# EAGLE design P2N-002 (EAGLE 7.1.0)
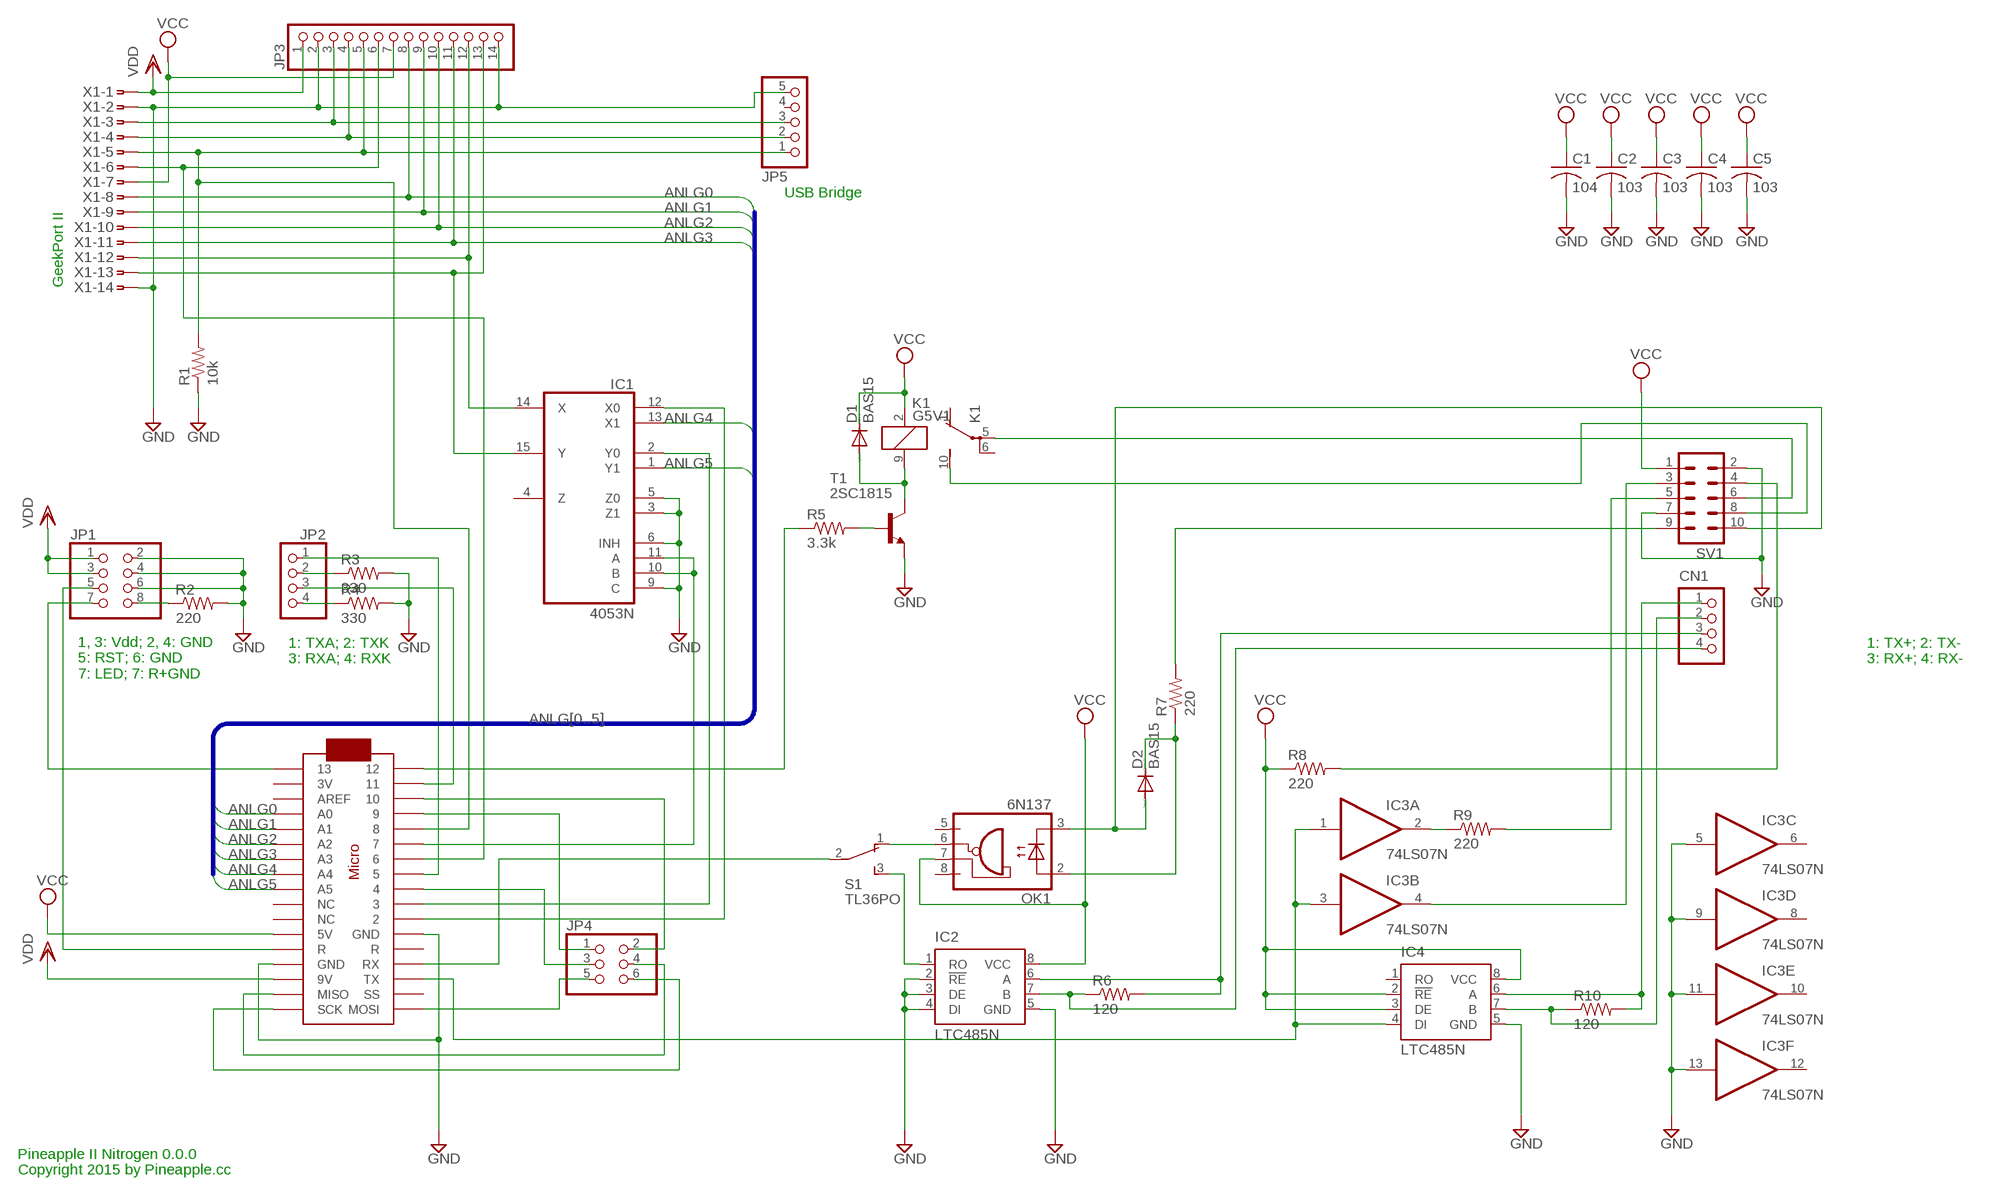
[diagram p0: schematic, sheet 1]

## Parts
C1  104  C-US025-025X050  [C025-025X050]
C2  103  C-US025-025X050  [C025-025X050]
C3  103  C-US025-025X050  [C025-025X050]
C4  103  C-US025-025X050  [C025-025X050]
C5  103  C-US025-025X050  [C025-025X050]
CN1  S4B-PH-K-S  [S4B-PH-K-S]
D1  BAS15  [DO34-7]
D2  BAS15  [DO34-7]
IC1  4053N  [DIL16]
IC2  LTC485N  [DIL08]
IC3  74LS07N  [DIL14]
IC4  LTC485N  [DIL08]
JP1  PINHD-2X4  [2X04]
JP2  PINHD-1X4  [1X04]
JP3  PINHD-1X14  [1X14]
JP4  PINHD-2X3  [2X03]
JP5  PINHD-1X5/90  [1X05/90]
K1  G5V1  [G5V1]
MC1  ARDUINOMICRO  [ARDUINOMICRO]
OK1  6N137  [DIL08]
R1  10k  R-US_0204/5  [0204/5]
R2  220  R-US_0204/5  [0204/5]
R3  330  R-US_0204/5  [0204/5]
R4  330  R-US_0204/5  [0204/5]
R5  3.3k  R-US_0204/5  [0204/5]
R6  120  R-US_0204/5  [0204/5]
R7  220  R-US_0204/5  [0204/5]
R8  220  R-US_0204/5  [0204/5]
R9  220  R-US_0204/5  [0204/5]
R10  120  R-US_0204/5  [0204/5]
S1  TL36PO  [TL3XPO]
SV1  ML10L  [ML10L]
T1  2SC1815  [TO92-ECB]
X1  HIROSE-DXLM  [HIROSE-DXLM]

## Nets
ANLG0: JP3.8 MC1.P$31(A0) X1.8
ANLG1: JP3.9 MC1.P$30(A1) X1.9
ANLG2: JP3.10 MC1.P$29(A2) X1.10
ANLG3: JP3.11 MC1.P$28(A3) X1.11
ANLG4: IC1.13(X1) MC1.P$27(A4)
ANLG5: IC1.1(Y1) MC1.P$26(A5)
GEEK16: IC1.10(B) IC1.11(A) MC1.P$6
GND: C1.2 C2.2 C3.2 C4.2 C5.2 IC1.3(Z1) IC1.5(Z0) IC1.6(INH) IC1.9(C) IC2.2(!RE) IC2.3(DE) IC2.4(DI) IC2.5(GND) IC3.5(C:I) IC3.9(D:I) IC3.11(E:I) IC3.13(F:I) IC4.5(GND) JP1.2 JP1.4 JP1.6 JP3.2 JP3.14 JP5.5 MC1.P$12(GND) MC1.P$21(GND) R1.1 R2.2 R3.2 R4.2 SV1.2 SV1.7 T1.E X1.2 X1.14
MIDI1: CN1.1 IC4.6(A) R10.2
MIDI3: CN1.2 IC4.7(B) R10.1
MIDI6: IC3.1(A:I) IC3.3(B:I) IC4.4(DI) MC1.P$15(TX)
MIDI11: CN1.3 IC2.6(A) R6.2
MIDI13: CN1.4 IC2.7(B) R6.1
MIDI15: D2.A OK1.3(C) SV1.10
MIDIRX: OK1.6(VO) S1.1(O)
N$1: IC3.4(B:O) SV1.3
N$2: IC3.2(A:O) R9.1
N$3: JP1.5 MC1.P$13(R)
N$4: JP1.7 MC1.P$34
N$5: R7.2 SV1.9
N$6: D1.A K1.9 T1.C
N$7: MC1.P$14(RX) S1.2(P)
N$8: R5.2 T1.B
N$9: JP4.3 MC1.P$9
N$10: R9.2 SV1.5
N$11: JP4.5 MC1.P$17(MOSI)
N$12: R8.2 SV1.4
N$13: JP4.6 MC1.P$18(SCK)
N$14: K1.10(2:S) SV1.8
N$15: D2.C OK1.2(A) R7.1
N$16: K1.5(2:P) SV1.6
N$17: JP2.2 R3.1
N$18: JP2.4 R4.1
N$19: IC1.2(Y0) MC1.P$10
N$20: JP2.1 MC1.P$8
N$21: JP2.3 MC1.P$2
N$22: MC1.P$1 R5.1
N$23: IC1.12(X0) MC1.P$11
N$24: JP3.5 JP5.1 MC1.P$5 R1.2 X1.5
N$25: JP3.4 JP5.2 X1.4
N$26: JP3.3 JP5.3 X1.3
N$27: JP3.6 MC1.P$7 X1.6
N$28: IC1.14(X) JP3.12 X1.12
N$29: IC1.15(Y) JP3.13 X1.13
N$30: JP4.1 MC1.P$4
N$31: JP4.2 MC1.P$3
N$32: JP1.8 R2.1
N$33: JP4.4 MC1.P$19(MISO)
VCC: C1.1 C2.1 C3.1 C4.1 C5.1 D1.C IC2.8(VCC) IC4.2(!RE) IC4.3(DE) IC4.8(VCC) JP3.7 K1.2 MC1.P$23(5V) OK1.7(VE) R8.1 SV1.1 X1.7
VDD: JP1.1 JP1.3 JP3.1 MC1.P$20(9V) X1.1
XMIDIRX: IC2.1(RO) S1.3(S)
Unconnected: IC1.4(Z) IC3.6(C:O) IC3.8(D:O) IC3.10(E:O) IC3.12(F:O) IC4.1(RO) JP5.4 K1.1(2:O) K1.6(2:P) MC1.P$16(SS) MC1.P$22(R) MC1.P$24(NC) MC1.P$25(NC) MC1.P$32(AREF) MC1.P$33(3V) OK1.5(GND) OK1.8(VCC)

## Buses
ANLG[0..5]

## Notes on the sheet
- USB Bridge
- GeekPort II
- 1: TXA; 2: TXK
  3: RXA; 4: RXK
- 1: TX+; 2: TX-
  3: RX+; 4: RX-
- 1, 3: Vdd; 2, 4: GND
  5: RST; 6: GND
  7: LED; 7: R+GND
- Pineapple II Nitrogen 0.0.0
  Copyright 2015 by Pineapple.cc

## Power pins joined to a net without a drawn wire
GND: IC1.8(GND) IC3.7(P:GND)
VCC: IC1.16(VCC) IC3.14(P:VCC)
VEE: IC1.7(VEE)

## Library data of the parts
C1-C5 = rcl:C-US: CAPACITOR, American symbol
CN1 = jst-ph:S4B-PH-*: Wire-to-Board 2.0mm pitch side mount connector Source: http://www.jst-mfg.com/product/pdf/jpn/PH.pdf http://www.jst-mfg.com/product/detail.php?series=199
D1 D2 = diode:BAS15: DIODE high speed
IC1 = 40xx:4053: Triple 2-channel ANALOG MULTIPLEXER
IC2 IC4 = linear-technology:LTC485: Low Power RS485 Interface Transceiver Source: http://www.linear.com/pc/downloadDocument.do?navId=H0,C1,C1007,C1017,P2064,D1718; OC_FARNELL: unknown; OC_NEWARK: unknown
IC3 = 74xx-us:74*07: Hex BUFFER, open collector high-voltage output
JP1 = pinhead:PINHD-2X4: PIN HEADER
JP2 = pinhead:PINHD-1X4: PIN HEADER
JP3 = pinhead:PINHD-1X14: PIN HEADER
JP4 = pinhead:PINHD-2X3: PIN HEADER
JP5 = pinhead:PINHD-1X5: PIN HEADER
K1 = relay:G5V1: RELAY 1 x switch, 0.5 A/125 V AC, 1 A/24 V DC , Omron; MPN: G5V-1-DC24; OC_FARNELL: 9949593; OC_NEWARK: 36M6377
MC1 = adafruit:ARDUINOMICRO
OK1 = optocoupler:6N137: MOTOROLA OPTO COUPLER; MPN: 6N137; OC_FARNELL: 1328376; OC_NEWARK: 52M1895
R1-R10 = resistor:R-US_: RESISTOR, American symbol
S1 = switch:TL36PO: TINY SWITCH ON - ON Source: http://www2.produktinfo.conrad.com/datenblaetter/700000-724999/705152-da-01-de-Subminiaturschalter_TL_36YO.pdf
SV1 = con-ml:ML10L: HARTING; OC_FARNELL: unknown; OC_NEWARK: unknown
T1 = transistor:2SC1815: NPN EPITAXIAL TRANSISTOR Source: TOSHIBA .. 2SC1815 1.pdf
X1 = con-hirose-dxlm:HIROSE-DXLM: Hirose DXLM connector

## Board
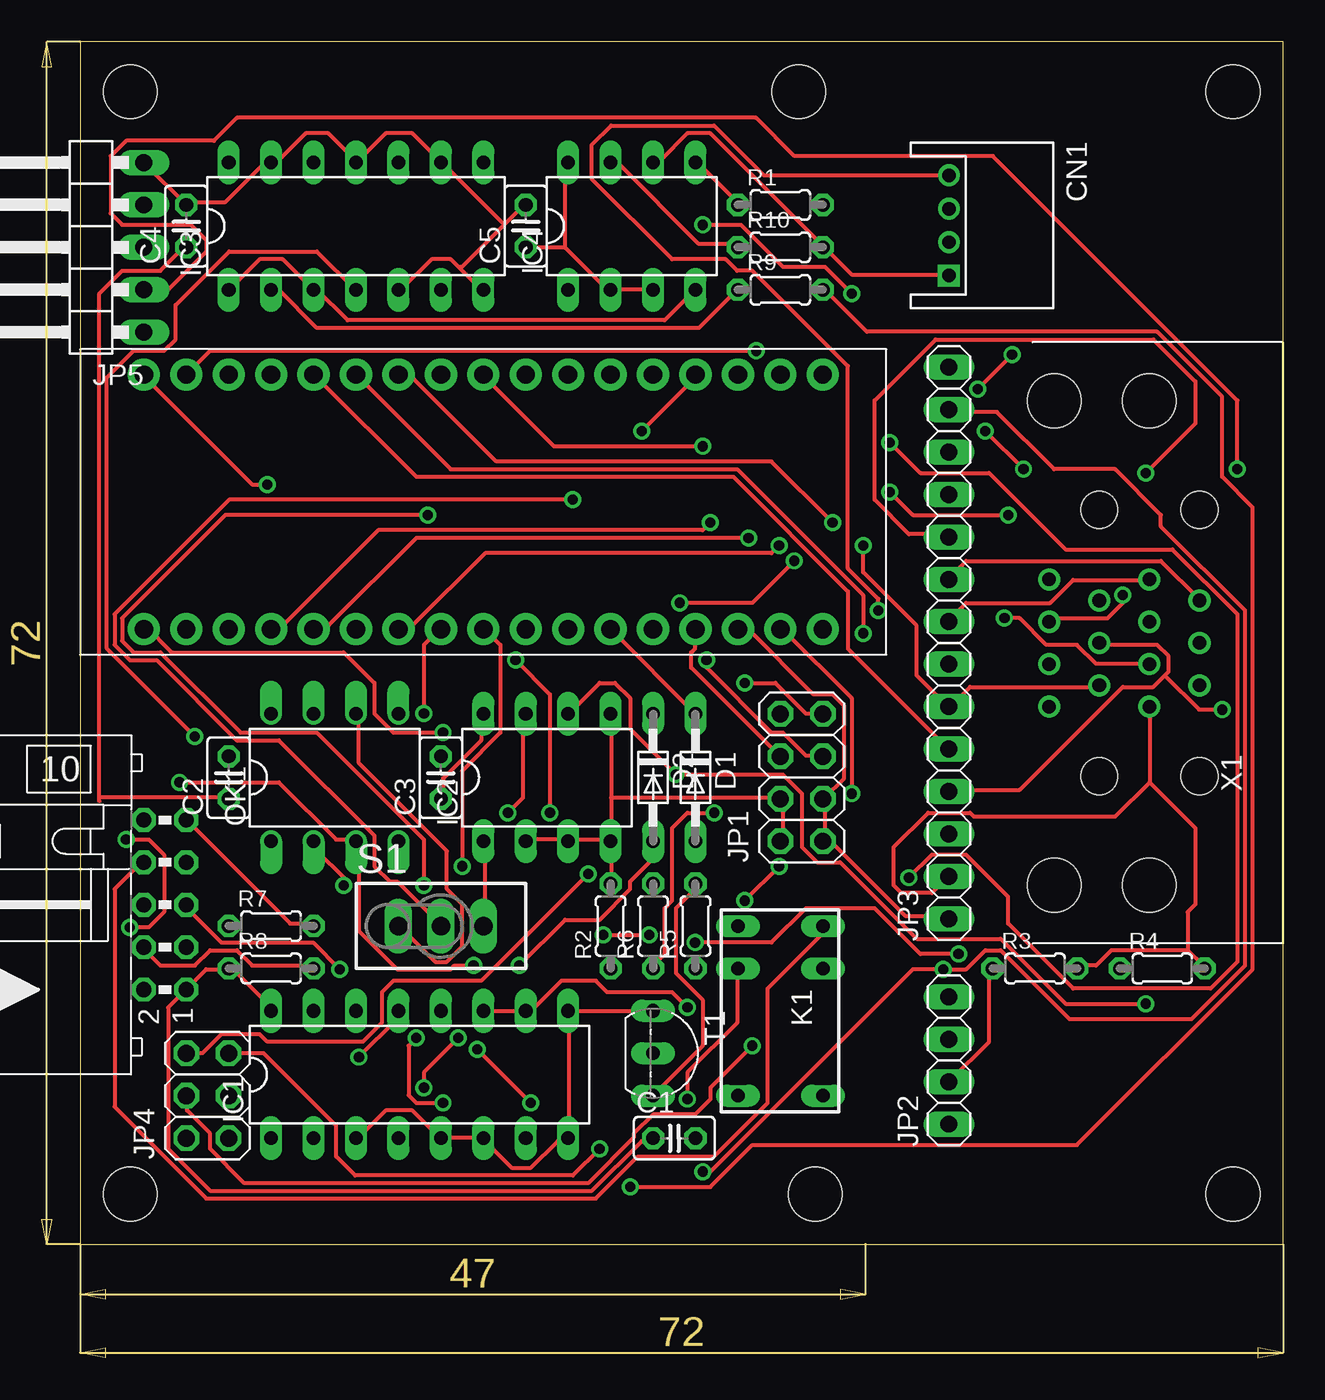
[diagram p1: board, top side]
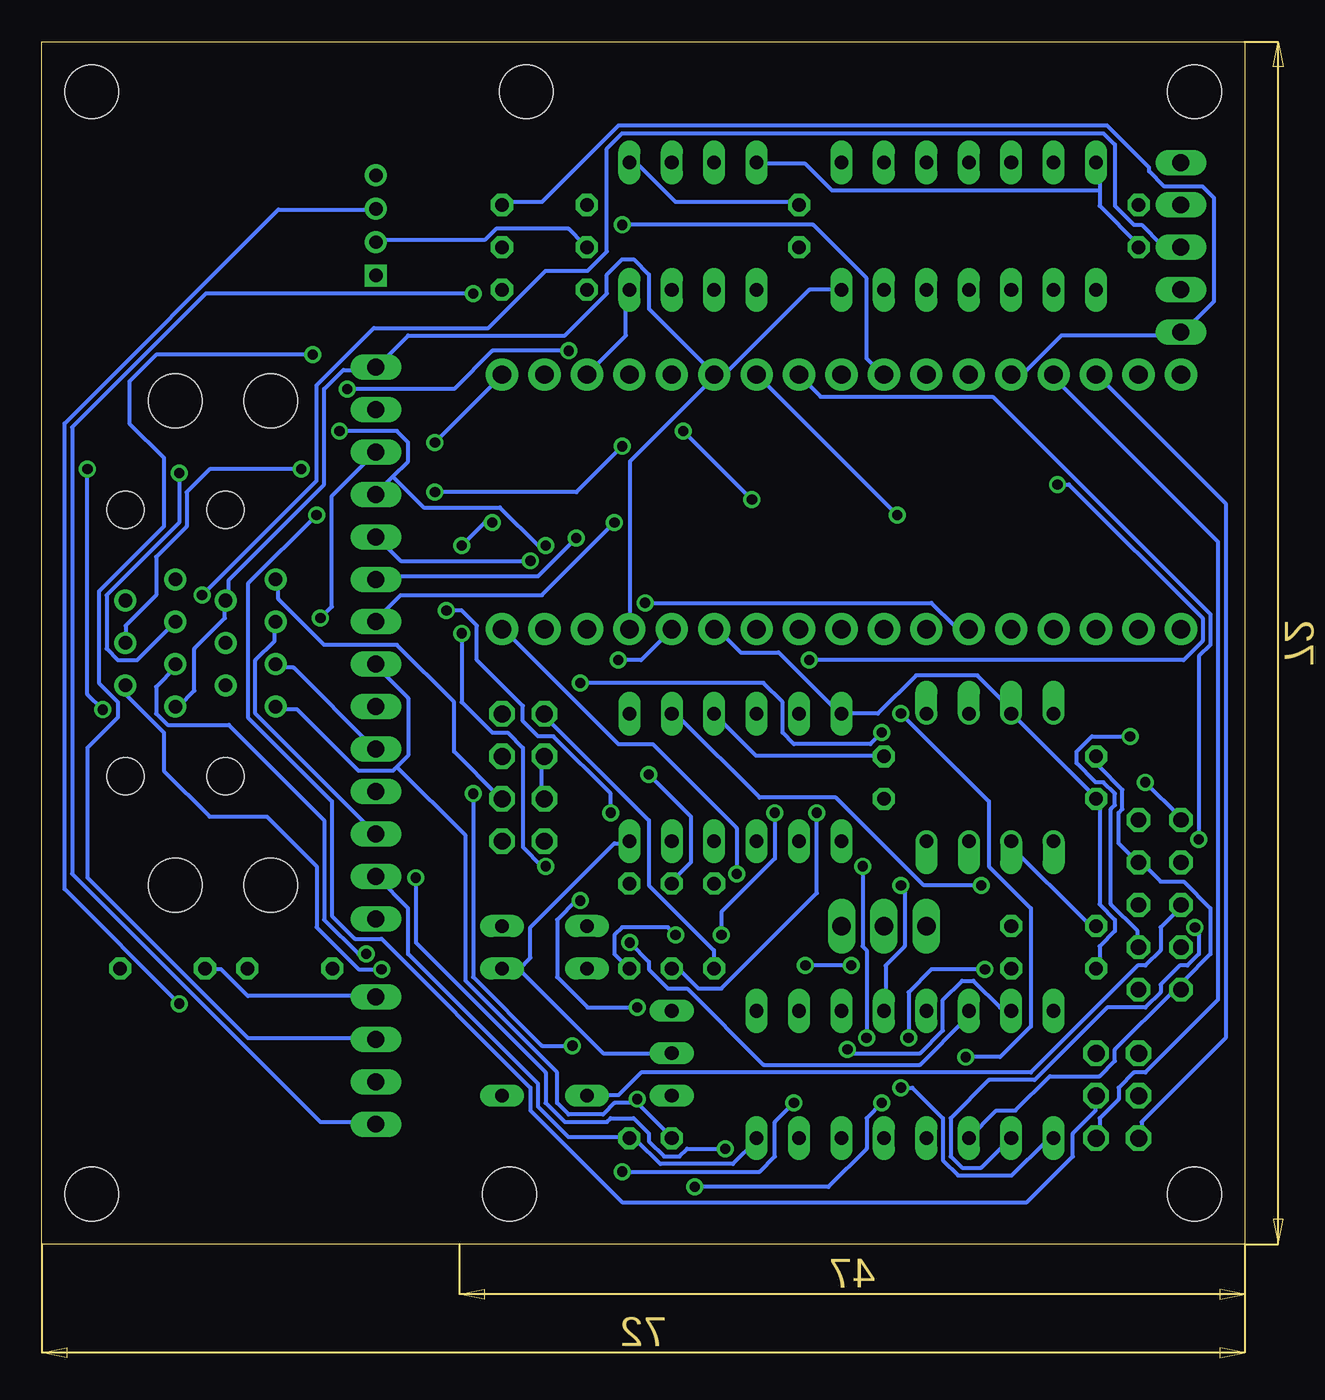
[diagram p2: board, bottom side, seen from below]

Size 72 x 72 mm. Coordinates in mm from the lower left corner, seen from the top.
Outline: 0,0 72,0 72,72 0,72 0,0
Copper layers (1*16): Top 0.035mm / dielectric 1.5mm / Bottom 0.035mm
Design rules "default": minimum track width 10mil, minimum drill 24mil, track to track 8mil, track to pad 8mil, pad to pad 8mil, via to via 8mil, smd to smd 8mil, copper to edge 40mil, drill to drill 8mil, minimum pad ring 10mil, minimum via ring 8mil, stop-mask expansion 4mil, vias tented up to drill 0mil, thermal gap 10mil
Holes 3.2 mm at 3,3 3,69 69,3 69,69 44,3 43,69

### Footprints (pad centres in the part's own frame; a part is rotated, then mirrored left to right if it is on the bottom)
C025-025X050 = drill 0.813 octagon: 1 -1.27,0; 2 1.27,0
S4B-PH-K-S = drill 0.8 square: 1 3,0 | drill 0.8: 2 1,0; 3 -1,0; 4 -3,0
DO34-7 = drill 0.813 long: A 3.81,0; C -3.81,0
DIL16 = drill 0.813 long: 1 -8.89,-3.81; 2 -6.35,-3.81; 3 -3.81,-3.81; 4 -1.27,-3.81; 5 1.27,-3.81; 6 3.81,-3.81; 7 6.35,-3.81; 8 8.89,-3.81; 9 8.89,3.81; 10 6.35,3.81; 11 3.81,3.81; 12 1.27,3.81; 13 -1.27,3.81; 14 -3.81,3.81; 15 -6.35,3.81; 16 -8.89,3.81
DIL08 = drill 0.813 long: 1 -3.81,-3.81; 2 -1.27,-3.81; 3 1.27,-3.81; 4 3.81,-3.81; 5 3.81,3.81; 6 1.27,3.81; 7 -1.27,3.81; 8 -3.81,3.81
DIL14 = drill 0.813 long: 1 -7.62,-3.81; 2 -5.08,-3.81; 3 -2.54,-3.81; 4 0,-3.81; 5 2.54,-3.81; 6 5.08,-3.81; 7 7.62,-3.81; 8 7.62,3.81; 9 5.08,3.81; 10 2.54,3.81; 11 0,3.81; 12 -2.54,3.81; 13 -5.08,3.81; 14 -7.62,3.81
2X04 = drill 1.016 octagon: 1 -3.81,-1.27; 2 -3.81,1.27; 3 -1.27,-1.27; 4 -1.27,1.27; 5 1.27,-1.27; 6 1.27,1.27; 7 3.81,-1.27; 8 3.81,1.27
1X04 = drill 1.016 long: 1 -3.81,0; 2 -1.27,0; 3 1.27,0; 4 3.81,0
1X14 = drill 1.016 long: 1 -16.51,0; 2 -13.97,0; 3 -11.43,0; 4 -8.89,0; 5 -6.35,0; 6 -3.81,0; 7 -1.27,0; 8 1.27,0; 9 3.81,0; 10 6.35,0; 11 8.89,0; 12 11.43,0; 13 13.97,0; 14 16.51,0
2X03 = drill 1.016 octagon: 1 -2.54,-1.27; 2 -2.54,1.27; 3 0,-1.27; 4 0,1.27; 5 2.54,-1.27; 6 2.54,1.27
1X05/90 = drill 1.016 long: 1 -5.08,-3.81; 2 -2.54,-3.81; 3 0,-3.81; 4 2.54,-3.81; 5 5.08,-3.81
G5V1 = drill 0.813 long: 1 -5.08,-2.54; 2 -2.54,-2.54; 5 5.08,-2.54; 6 5.08,2.54; 9 -2.54,2.54; 10 -5.08,2.54
ARDUINOMICRO = drill 1.1 pad 1.93: P$1 -20.32,7.62; P$2 -17.78,7.62; P$3 -15.24,7.62; P$4 -12.7,7.62; P$5 -10.16,7.62; P$6 -7.62,7.62; P$7 -5.08,7.62; P$8 -2.54,7.62; P$9 0,7.62; P$10 2.54,7.62; P$11 5.08,7.62; P$12 12.7,-7.62; P$13 10.16,-7.62; P$14 12.7,7.62; P$15 15.24,7.62; P$16 17.78,7.62; P$17 20.32,7.62; P$18 20.32,-7.62; P$19 17.78,-7.62; P$20 15.24,-7.62; P$21 7.62,7.62; P$22 10.16,7.62; P$23 7.62,-7.62; P$24 5.08,-7.62; P$25 2.54,-7.62; P$26 0,-7.62; P$27 -2.54,-7.62; P$28 -5.08,-7.62; P$29 -7.62,-7.62; P$30 -10.16,-7.62; P$31 -12.7,-7.62; P$32 -15.24,-7.62; P$33 -17.78,-7.62; P$34 -20.32,-7.62
DIL08' = drill 0.813 offset: 1 -3.81,-3.81; 2 -1.27,-3.81; 3 1.27,-3.81; 4 3.81,-3.81; 5 3.81,3.81; 6 1.27,3.81; 7 -1.27,3.81; 8 -3.81,3.81
0204/5 = drill 0.813 octagon: 1 -2.54,0; 2 2.54,0
TL3XPO = drill 1.1 pad 1.422 long: 1 -2.54,0; 2 0,0; 3 2.54,0
ML10L = drill 0.914 octagon: 1 -5.08,-1.27; 2 -5.08,1.27; 3 -2.54,-1.27; 4 -2.54,1.27; 5 0,-1.27; 6 0,1.27; 7 2.54,-1.27; 8 2.54,1.27; 9 5.08,-1.27; 10 5.08,1.27
TO92-ECB = drill 0.813 long: B 2.54,0; C 0,0; E -2.54,0
HIROSE-DXLM = drill 0.813: 1 3.81,9; 2 2.54,6; 3 1.27,9; 4 0,6; 5 -1.27,9; 6 -2.54,6; 7 -3.81,9; 8 3.81,3; 9 2.54,0; 10 1.27,3; 11 0,0; 12 -1.27,3; 13 -2.54,0; 14 -3.81,3 | hole 2.2: -7.97,6; 7.97,0; -7.97,0; 7.97,6 | hole 3.2: 14.5,3; -14.5,3; -14.5,8.7; 14.5,8.7

### Placement (x,y rotation side)
C1  35.56,6.35 0 top
C2  8.89,27.94 90 top
C3  21.59,27.94 90 top
C4  6.35,60.96 90 top
C5  26.67,60.96 90 top
CN1  52,61 270 top
D1  36.83,27.94 270 top
D2  34.29,27.94 270 top
IC1  20.32,10.16 0 top
IC2  27.94,27.94 0 top
IC3  16.51,60.96 0 top
IC4  33.02,60.96 0 top
JP1  43.18,27.94 90 top
JP2  52,11 90 top
JP3  52,36 90 top
JP4  7.62,8.89 90 top
JP5  0,59.69 90 top
K1  41.91,13.97 270 top
MC1  24.13,44.45 0 top
OK1  6N137  [DIL08']  15.24,27.94 0 top
R1  41.91,62.23 0 top
R2  31.75,19.05 90 top
R3  57.15,16.51 0 top
R4  64.77,16.51 0 top
R5  36.83,19.05 90 top
R6  34.29,19.05 90 top
R7  11.43,19.05 0 top
R8  11.43,16.51 0 top
R9  41.91,57.15 0 top
R10  41.91,59.69 0 top
S1  21.59,19.05 0 top
SV1  5.08,20.32 90 top
T1  34.29,11.43 270 top
X1  67,36 90 top

### Tracks (layer width: path | path; a pad name or v marks a point on that pad's centre or on a via)
ANLG0  (via drill 0.61)
  Top 0.254: X1.8 63.78,39.78 59.44,39.78 58.06,38.41 53.03,38.41 52.12,37.49 JP3.8 | v37.72,43.2 37.26,42.75 17.83,42.75 12.12,37.03 11.43,37.03 MC1.P$31
  Bottom 0.254: v37.72,43.2 42.06,38.86 50.52,38.86 51.89,37.49 JP3.8
ANLG1  (via drill 0.61)
  Top 0.254: X1.9 66.98,38.63 64.69,40.92 53.03,40.92 52.12,40.01 JP3.9 | v40.01,42.29 20.12,42.29 14.86,37.03 14.17,37.03 MC1.P$30
  Bottom 0.254: v40.01,42.29 42.29,40.01 51.89,40.01 JP3.9
ANLG2  (via drill 0.61)
  Top 0.254: v63.78,46.18 66.75,49.15 66.75,51.66 64.24,54.18 51.21,54.18 47.55,50.52 47.55,44.58 49.61,42.52 51.89,42.52 JP3.10 | v35.89,38.41 40.23,38.41 v42.75,40.92
  Bottom 0.254: v63.78,46.18 63.78,43.2 68.12,38.86 68.12,35.66 67.44,34.98 66.29,34.98 X1.10 | v35.89,38.41 18.75,38.41 17.37,37.03 16.69,37.03 MC1.P$29 | v42.75,40.92 50.52,40.92 51.89,42.29 JP3.10
ANLG3  (via drill 0.61)
  Top 0.254: v54.18,48.69 v56.46,46.41 | v41.83,41.83 41.38,41.38 24.23,41.38 19.89,37.03 19.2,37.03 MC1.P$28
  Bottom 0.254: v56.46,46.41 61.95,46.41 63.32,45.03 63.32,42.98 65.15,41.15 65.15,38.86 66.98,37.03 66.98,36.12 X1.11 | v54.18,48.69 50.75,48.69 50.06,48.01 50.06,46.86 50.98,45.95 | 50.98,45.95 51.89,45.03 JP3.11 | v41.83,41.83 42.29,41.83 44.58,44.12 49.15,44.12 50.98,45.95
ANLG4  (via drill 0.61)
  Top 0.254: v16.69,11.2 18.97,13.49 18.97,13.95 IC1.13 | v20.57,31.77 20.57,35.89 21.49,36.8 MC1.P$27
  Bottom 0.254: v16.69,11.2 14.63,11.2 12.8,13.03 12.8,20.12 15.32,22.63 15.32,26.52 v20.57,31.77
ANLG5  (via drill 0.61)
  Top 0.254: v20.57,9.37 20.57,10.29 v22.63,12.34 | v22.86,22.63 22.86,28.35 25.15,30.63 25.15,35.89 24.23,36.8 MC1.P$26
  Bottom 0.254: v20.57,9.37 19.89,9.37 18.06,7.54 18.06,5.03 17.14,4.12 13.95,4.12 11.89,6.17 11.43,6.17 IC1.1 | v22.63,12.34 22.63,17.6 22.86,17.83 v22.86,22.63
GEEK16  (via drill 0.61)
  Top 0.254: IC1.11 24.23,13.95 26.52,13.95 IC1.10 26.75,14.17 27.2,14.17 28.8,15.77 30.86,15.77 31.55,15.09 35.43,15.09 v36.35,14.17 | v41.83,22.63 v39.78,20.57 | v46.86,36.58 46.86,38.86 39.32,46.41 22.17,46.41 MC1.P$6
  Bottom 0.254: v36.35,14.17 39.32,14.17 41.15,16 41.15,19.43 40.01,20.57 v39.78,20.57 | v41.83,22.63 42.06,22.63 43.2,23.77 43.2,29.72 44.12,30.63 45.03,30.63 46.86,32.46 v46.86,36.58
GND
  Top 0.254: JP1.2 42.06,24.23 42.06,26.52 JP1.4 41.83,26.75 31.77,26.75 | MC1.P$12 36.8,36.8 36.8,35.66 36.58,35.43 36.58,34.52 41.83,29.26 JP1.6 | R2.2 31.77,21.72 31.77,24 IC2.4 | IC2.2 26.75,24.23 29.03,24.23 IC2.3 29.26,24.23 31.55,24.23 IC2.4 | 31.77,26.75 31.77,31.55 IC2.5 | 31.77,26.75 31.77,24.23 IC2.4 | JP5.5 C4.2 6.4,62.41 8.69,62.41 10.97,64.69 11.43,64.69 IC3.13 11.43,64.92 11.89,64.92 13.49,66.52 14.86,66.52 16.46,64.92 IC3.11 16.69,64.92 18.29,66.52 19.89,66.52 21.49,64.92 IC3.9 21.72,64.69 25.38,61.04 | IC4.5 37.03,64.69 39.32,62.41 R1.1 | 22.63,58.52 24,57.15 IC3.7 | 22.63,58.52 22.17,58.98 21.03,58.98 19.2,57.15 IC3.5 | 25.38,61.04 22.86,58.52 22.63,58.52 | 25.38,61.04 26.52,62.18 C5.2 | 66.29,17.6 61.72,17.6 60.81,16.69 59.89,16.69 R3.2 | 66.29,17.6 67.21,16.69 R4.2 | 66.29,17.6 66.29,19.89 66.75,20.34 66.75,24.92 64.01,27.66 | 64.01,27.66 64.01,32 X1.14 | 29.26,13.95 34.29,13.95 T1.E | IC1.3 16.69,6.4 18.29,8 19.89,8 21.49,6.4 IC1.5 21.72,6.4 24,6.4 IC1.6 24.23,6.17 25.83,4.57 26.98,4.57 28.57,6.17 29.03,6.17 IC1.8 29.26,6.4 29.26,13.95 | 29.26,13.95 IC1.9 | 64.01,27.66 61.95,25.6 53.49,25.6 53.26,25.83 50.75,25.83 48.69,23.77 48.69,21.49 49.15,21.03 50.98,21.03 51.89,21.95 JP3.2
  Bottom 0.254: JP1.6 42.06,29.03 42.06,26.75 JP1.4 | IC2.5 29.26,29.26 21.72,29.26 C3.2 | IC3.7 26.06,57.15 31.09,52.12 31.55,52.12 MC1.P$21 | IC4.5 36.8,64.69 36.35,64.69 34.06,62.41 26.75,62.41 C5.2 | MC1.P$12 36.8,37.03 36.8,46.86 31.77,51.89 MC1.P$21 | X1.14 63.78,32.23 62.87,33.15 62.87,35.66 61.04,37.49 61.04,38.41 X1.2 60.81,38.63 60.81,39.78 55.09,45.49 55.09,51.21 53.95,52.35 52.12,52.35 JP3.14 51.89,52.58 50.06,54.41 40.69,54.41 38.18,56.92 38.18,58.06 37.26,58.98 36.58,58.98 35.66,58.06 35.66,56.01 31.77,52.12 MC1.P$21 | C2.2 8.69,29.03 8.69,28.57 7.32,27.2 7.32,26.06 7.54,25.83 7.54,24 6.4,22.86 SV1.7 6.17,22.86 5.03,21.72 3.66,21.72 2.06,20.12 2.06,17.37 3.66,15.77 3.66,15.32 SV1.2 3.89,15.09 4.34,15.09 7.77,11.66 7.77,10.97 8.69,10.06 11.66,10.06 13.72,8 14.86,8 IC1.3 | IC1.8 29.26,6.17 30.63,4.8 34.98,4.8 36.35,6.17 36.8,6.17 C1.2 37.03,6.4 40.46,6.4 42.29,8.23 42.29,9.6 50.06,17.37 50.06,20.12 51.89,21.95 JP3.2
MIDI1
  Top 0.254: CN1.1 51.89,58.06 46.18,58.06 44.58,59.66 R10.2 44.35,59.89 37.72,66.52 36.35,66.52 34.75,64.92 34.29,64.92 IC4.6
MIDI3
  Top 0.254: IC4.7 31.77,64.69 32.23,64.69 37.03,59.89 39.32,59.89 R10.1
  Bottom 0.254: CN1.2 51.89,60.12 45.49,60.12 44.81,60.81 40.46,60.81 39.55,59.89 R10.1
MIDI6
  Top 0.254: IC3.1 8.91,57.15 10.74,58.98 12.12,58.98 13.95,57.15 IC3.3 14.17,57.15 16,55.32 34.98,55.32 36.8,57.15 IC4.4
  Bottom 0.254: MC1.P$15 37.03,54.41 37.03,57.15 IC4.4
MIDI11  (via drill 0.61)
  Top 0.254: v63.78,14.4 58.98,14.4 55.09,18.29 50.06,18.29 45.49,22.86 44.12,22.86 43.2,23.77 43.2,26.98 42.06,28.12 v35.66,28.12 32.92,30.86 32.92,32.69 32,33.6 31.09,33.6 29.26,31.77 IC2.6
  Bottom 0.254: v63.78,14.4 70.64,21.26 70.64,49.15 57.84,61.95 52.12,61.95 CN1.3 | v35.66,28.12 33.15,25.6 33.15,22.86 34.29,21.72 R6.2
MIDI13  (via drill 0.61)
  Top 0.254: v47.78,37.95 47.78,38.63 45.95,40.46 45.95,52.58 40.23,58.29 39.32,58.29 38.63,58.98 35.43,58.98 30.63,63.78 30.63,65.84 31.77,66.98 37.95,66.98 40.92,64.01 51.89,64.01 CN1.4 | v37.95,25.83 36.35,25.83 35.43,24.92 35.43,20.57 34.98,20.12 34.98,17.37 34.29,16.69 R6.1 | v25.6,25.83 26.52,26.75 26.52,31.55 IC2.7
  Bottom 0.254: v47.78,37.95 46.86,37.95 45.95,37.03 45.95,34.98 43.2,32.23 43.2,31.32 42.29,30.4 41.38,30.4 37.95,26.98 v37.95,25.83 | v25.6,25.83 25.6,21.03 31.32,15.32 32.69,15.32 33.83,16.46 34.29,16.46 R6.1
MIDI15  (via drill 0.61)
  Top 0.254: v5.94,27.66 11.89,27.66 15.32,24.23 16.46,24.23 OK1.3 16.69,24 16.69,18.75 18.97,16.46 22.17,16.46 22.4,16.69 v23.55,16.69 | D2.A 34.29,23.09 32.92,21.72 32.92,21.26 31.09,19.43 29.03,19.43 v26.29,16.69
  Bottom 0.254: v5.94,27.66 3.89,25.6 SV1.10 | v23.55,16.69 v26.29,16.69
MIDIRX
  Top 0.254: OK1.6 16.69,31.55 16.69,28.8 21.95,23.55 21.95,21.26 22.86,20.34 22.86,17.83 21.95,16.92 21.26,16.92 19.2,18.97 S1.1
N$1  (via drill 0.61)
  Top 0.254: v6.86,30.4 1.6,35.66 1.6,51.89 3.2,53.49 5.03,53.49 5.71,54.18 5.71,56.24 8.91,59.44 14.17,59.44 16.46,57.15 IC3.4
  Bottom 0.254: v6.86,30.4 9.14,30.4 10.06,29.49 10.06,28.8 8.91,27.66 8.46,27.66 7.77,26.98 7.77,26.29 8,26.06 8,20.34 6.4,18.75 6.4,17.83 SV1.3
N$2
  Top 0.254: IC3.2 11.89,57.15 14.17,54.86 37.03,54.86 39.32,57.15 R9.1
N$3  (via drill 0.61)
  Top 0.254: v37.49,34.98 37.49,34.52 41.38,30.63 42.06,30.63 43.43,29.26 44.35,29.26 JP1.5
  Bottom 0.254: v37.49,34.98 36.12,34.98 34.29,36.8 MC1.P$13
N$4  (via drill 0.61)
  Top 0.254: v39.78,33.6 41.6,33.6 43.43,31.77 44.35,31.77 JP1.7 | v21.72,30.63 18.75,30.63 17.6,31.77 17.6,33.6 15.77,35.43 5.49,35.43 3.89,37.03 MC1.P$34
  Bottom 0.254: v39.78,33.6 28.8,33.6 27.66,32.46 27.66,30.63 26.98,29.95 22.4,29.95 v21.72,30.63
N$5
  Top 0.254: R7.2 13.95,19.2 12.57,19.2 6.4,25.38 SV1.9
N$6
  Bottom 0.254: T1.C 38.41,11.43 43.43,16.46 | 43.43,16.46 44.35,16.46 K1.9 43.43,16.46 | 43.43,16.46 42.75,17.14 42.75,18.97 37.72,24 37.03,24 D1.A
N$7  (via drill 0.61)
  Top 0.254: v29.49,44.58 8.91,44.58 2.06,37.72 2.06,35.89 2.97,34.98 4.57,34.98 9.37,30.18 11.89,30.18 17.6,24.46 17.6,22.63 18.52,21.72 18.97,21.72 21.49,19.2 S1.2 | v33.6,48.69 36.8,51.89 MC1.P$14
  Bottom 0.254: v33.6,48.69 v29.49,44.58
N$8
  Top 0.254: T1.B 34.29,8.91 37.26,11.89 37.26,14.63 35.66,16.23 35.66,20.12 37.03,21.49 R5.2
N$9  (via drill 0.61)
  Top 0.254: v55.55,43.66 49.84,43.66 v48.46,45.03 | v37.26,47.78 28.35,47.78 24.23,51.89 MC1.P$9
  Bottom 0.254: v55.55,43.66 59.66,39.55 59.66,31.55 54.63,26.52 54.63,19.66 53.26,18.29 51.66,18.29 42.75,9.37 42.75,8 37.26,2.52 13.03,2.52 10.29,5.26 10.29,6.63 8.91,8 8.91,8.69 JP4.3 | v48.46,45.03 40.01,45.03 v37.26,47.78
N$10  (via drill 0.61)
  Top 0.254: v32.92,3.43 37.72,3.43 40.23,5.94 59.66,5.94 70.18,16.46 70.18,44.12 68.35,45.95 68.35,50.75 64.47,54.63 47.09,54.63 44.58,57.15 R9.2 | v21.72,8.46 20.12,8.46 19.66,8.91 19.66,11.89 v20.12,12.34 | v15.54,16.46 13.95,18.06 8.46,18.06 6.4,20.12 SV1.5
  Bottom 0.254: v32.92,3.43 24.92,3.43 22.63,5.71 22.63,7.54 v21.72,8.46 | v20.12,12.34 20.12,15.09 18.75,16.46 v15.54,16.46
N$11  (via drill 0.61)
  Top 0.254: JP4.5 10.97,11.43 15.32,7.09 15.32,5.26 16.46,4.12 29.49,4.12 v31.09,5.71 | v49.61,21.95 50.98,23.32 53.03,23.32 55.55,20.8 55.55,19.2 59.44,15.32 67.67,15.32 69.27,16.92 69.27,37.72 65.38,41.6 58.98,41.6 54.41,46.18 50.29,46.18 v48.46,48.01
  Bottom 0.254: v31.09,5.71 33.38,5.71 33.83,5.26 34.75,5.26 35.66,6.17 35.66,6.63 36.58,7.54 37.95,7.54 38.18,7.32 40.69,7.32 41.83,8.46 41.83,10.29 49.61,18.06 v49.61,21.95 | v48.46,48.01 44.58,51.89 MC1.P$17
N$12
  Top 0.254: R8.2 13.95,16.69 10.29,16.69 9.37,17.6 7.77,17.6 6.86,16.69 4.8,16.69 3.89,17.6 SV1.4
N$13  (via drill 0.61)
  Top 0.254: JP4.6 7.32,11.43 8.46,12.57 10.74,12.57 11.2,12.12 16.92,12.12 18.06,13.26 18.06,15.09 18.75,15.77 24,15.77 v30.4,22.17
  Bottom 0.254: v30.4,22.17 30.4,24.92 35.43,29.95 37.49,29.95 44.35,36.8 MC1.P$18
N$14
  Top 0.254: K1.10 44.35,18.97 44.35,18.52 41.15,15.32 41.15,8.46 37.95,5.26 33.38,5.26 30.86,2.74 7.54,2.74 2.06,8.23 2.06,21.26 3.66,22.86 SV1.8
N$15  (via drill 0.61)
  Top 0.254: v15.77,21.49 15.77,21.95 14.17,23.55 14.17,24 OK1.2
  Bottom 0.254: R7.1 8.91,19.2 9.37,19.2 14.17,24 OK1.2 | v15.77,21.49 19.2,21.49 24.46,26.75 29.03,26.75 33.83,31.55 34.29,31.55 D2.C
N$16
  Bottom 0.254: K1.5 39.32,8.91 37.49,8.91 36.12,10.29 12.8,10.29 6.4,16.69 5.94,16.69 5.03,17.6 5.03,18.97 3.89,20.12 SV1.6
N$17
  Top 0.254: R3.1 54.41,16.46 54.41,12.12 52.12,9.83 JP2.2
N$18
  Bottom 0.254: R4.1 62.18,16.46 61.27,16.46 59.66,14.86 52.12,14.86 JP2.4
N$19  (via drill 0.61)
  Top 0.254: v2.97,18.97 4.12,18.97 5.03,19.89 5.03,23.32 4.12,24.23 v2.74,24.23
  Bottom 0.254: v2.97,18.97 2.74,18.75 2.74,17.37 3.43,16.69 3.89,16.69 5.03,15.54 5.03,15.09 5.94,14.17 8.23,14.17 12.57,9.83 15.32,9.83 17.6,7.54 17.6,5.26 16.92,4.57 15.77,4.57 14.17,6.17 IC1.2 | v2.74,24.23 2.74,35.2 2.06,35.89 2.06,37.72 15.09,50.75 25.38,50.75 26.52,51.89 MC1.P$10
N$20  (via drill 0.61)
  Top 0.254: v46.18,56.92 44.58,58.52 42.06,58.52 39.55,61.04 v37.26,61.04
  Bottom 0.254: v46.18,56.92 62.18,56.92 70.18,48.92 70.18,22.17 55.32,7.32 52.12,7.32 JP2.1 | v37.26,61.04 25.83,61.04 22.63,57.84 22.63,53.03 21.72,52.12 MC1.P$8
N$21  (via drill 0.61)
  Top 0.254: v53.72,51.21 v55.78,53.26 | v40.46,53.49 7.77,53.49 MC1.P$2
  Bottom 0.254: v55.78,53.26 65.15,53.26 66.75,51.66 66.75,49.15 64.69,47.09 64.69,42.98 68.58,39.09 68.58,33.6 67.44,32.46 67.44,31.55 69.27,29.72 69.27,21.95 59.66,12.34 52.12,12.34 JP2.3 | v53.72,51.21 47.32,51.21 45.03,53.49 v40.46,53.49
N$22  (via drill 0.61)
  Top 0.254: v31.32,18.52 v34.06,18.52 | v28.12,25.83 28.12,32.92 v26.06,34.98 | v11.2,45.49 10.29,45.49 3.89,51.89 MC1.P$1
  Bottom 0.254: v34.06,18.52 34.52,18.97 37.26,18.97 37.72,18.52 37.72,17.37 37.03,16.69 R5.1 | v31.32,18.52 31.32,19.89 28.12,23.09 v28.12,25.83 | v26.06,34.98 3.66,34.98 2.52,36.12 2.52,37.49 10.52,45.49 v11.2,45.49
N$23  (via drill 0.61)
  Top 0.254: v20.57,21.49 20.57,24.23 14.17,30.63 9.6,30.63 4.8,35.43 3.2,35.43 2.52,36.12 2.52,37.49 8.69,43.66 v20.8,43.66
  Bottom 0.254: v20.57,21.49 20.34,21.26 20.34,17.83 21.49,16.69 21.49,14.17 IC1.12 | MC1.P$11 v20.8,43.66
N$24
  Top 0.254: JP3.5 51.89,29.72 45.95,35.66 45.95,39.09 39.09,45.95 20.12,45.95 14.17,51.89 MC1.P$5
  Bottom 0.254: X1.5 57.84,34.52 56.92,34.52 52.12,29.72 JP3.5 | R1.2 44.35,62.41 42.06,62.41 37.49,66.98 8.23,66.98 5.71,64.47 5.71,64.24 4.8,63.32 2.52,63.32 1.83,62.64 1.83,56.46 3.66,54.63 JP5.1 3.89,54.41 10.97,54.41 13.26,52.12 13.95,52.12 MC1.P$5
N$25  (via drill 0.61)
  Top 0.254: 64.92,34.06 64.24,33.38 62.41,33.38 56.24,27.2 52.12,27.2 JP3.4 | 64.92,34.06 65.15,34.29 65.15,35.2 64.47,35.89 61.04,35.89 X1.4 | JP5.2 5.26,57.15 7.54,59.44 7.54,60.12 6.63,61.04 2.52,61.04 1.83,61.72 1.83,65.15 2.74,66.06 8,66.06 9.37,67.44 40.46,67.44 42.75,65.15 54.63,65.15 69.27,50.52 v69.27,46.41 | v68.35,32 66.98,32 64.92,34.06
  Bottom 0.254: v69.27,46.41 69.27,32.92 v68.35,32
N$26  (via drill 0.61)
  Top 0.254: v62.41,38.86 62.41,38.41 61.49,37.49 58.06,37.49 X1.3
  Bottom 0.254: X1.3 58.06,37.26 58.06,36.12 59.21,34.98 59.21,31.77 52.12,24.69 JP3.3 | v62.41,38.86 55.55,45.72 55.55,51.44 52.12,54.86 45.26,54.86 41.83,58.29 39.32,58.29 38.18,59.44 38.18,65.61 37.26,66.52 8.46,66.52 7.77,65.84 7.77,62.18 6.63,61.04 6.17,61.04 5.03,59.89 3.89,59.89 JP5.3
N$27  (via drill 0.61)
  Top 0.254: X1.6 60.81,33.38 53.26,33.38 52.12,32.23 JP3.6 51.89,32.23 50.06,34.06 50.06,37.03 46.86,40.23 v46.86,41.83 | v45.03,43.2 41.38,46.86 24.92,46.86 19.89,51.89 19.2,51.89 MC1.P$7
  Bottom 0.254: v45.03,43.2 45.49,43.2 v46.86,41.83
N$28  (via drill 0.61)
  Top 0.254: v36.8,18.06 41.38,18.06 43.43,20.12 47.55,20.12 50.29,17.37 v52.58,17.37 | v55.32,37.49 56.24,37.49 57.84,35.89 59.66,35.89 60.81,34.75 63.78,34.75 X1.12
  Bottom 0.254: v36.8,18.06 35.66,16.92 35.66,16.46 34.52,15.32 33.38,15.32 28.8,10.74 19.43,10.74 16.69,13.49 16.69,13.95 IC1.14 | v52.58,17.37 53.03,17.37 55.09,19.43 55.09,25.38 60.81,31.09 64.47,31.09 65.15,31.77 65.15,33.38 64.01,34.52 X1.12 | v55.32,37.49 54.63,38.18 54.63,44.81 52.12,47.32 JP3.12
N$29  (via drill 0.61)
  Top 0.254: v26.98,8.46 v23.77,11.66 | v37.26,4.34 37.72,4.34 49.84,16.46 v51.66,16.46 53.03,16.46 54.18,17.6 55.09,17.6 59.21,13.49 66.52,13.49 69.72,16.69 69.72,37.95 64.69,42.98 64.69,43.66 61.95,46.41 58.29,46.41 54.86,49.84 52.12,49.84 JP3.13
  Bottom 0.254: v23.77,11.66 23.55,11.43 19.43,11.43 18.06,12.8 18.06,14.63 16.92,15.77 16.23,15.77 14.63,14.17 14.17,14.17 IC1.15 | v26.98,8.46 28.12,7.32 28.12,5.26 29.03,4.34 v37.26,4.34 | v51.66,16.46 53.03,16.46 55.55,18.97 55.55,22.63 58.52,25.6 61.95,25.6 64.69,28.35 64.69,30.63 66.98,32.92 66.98,33.38 X1.13
N$30
  Bottom 0.254: JP4.1 8.69,6.4 8.69,7.54 7.54,8.69 7.54,9.37 6.63,10.29 5.94,10.29 1.6,14.63 1.6,42.06 11.43,51.89 MC1.P$4
N$31
  Bottom 0.254: JP4.2 6.17,6.4 6.17,7.32 1.14,12.34 1.14,44.35 8.69,51.89 MC1.P$3
N$32
  Bottom 0.254: R2.1 31.77,16.69 31.77,17.6 35.66,21.49 35.66,25.38 41.83,31.55 JP1.8
N$33  (via drill 0.61)
  Top 0.254: v40.23,11.89 37.72,9.37 37.72,8.69 36.8,7.77 34.29,7.77 33.15,6.63 33.15,6.4 30.4,3.66 9.83,3.66 7.77,5.71 7.77,6.63 6.4,8 6.4,8.69 JP4.4 | v46.18,26.98 46.18,32.69 42.06,36.8 MC1.P$19
  Bottom 0.254: v40.23,11.89 42.06,11.89 46.18,16 v46.18,26.98
VCC  (via drill 0.61)
  Top 0.254: 1.14,26.52 1.14,26.75 | 1.14,26.75 1.14,56.92 2.52,58.29 4.8,58.29 6.17,59.66 C4.1 | v36.35,8.69 36.35,10.29 39.32,13.26 39.32,16.46 K1.2 | C3.1 21.72,26.75 21.72,27.89 24,30.18 24,31.55 IC2.8 | MC1.P$23 D1.C | IC4.3 IC4.2 31.55,57.15 29.03,59.66 | 29.03,59.66 26.75,59.66 C5.1 | 29.03,59.66 29.03,64.69 IC4.8 | IC1.16 11.43,14.17 8.91,16.69 R8.1 8.69,16.46 7.54,16.46 6.4,15.32 SV1.1 6.17,15.09 5.26,14.17 5.26,5.71 7.77,3.2 30.63,3.2 33.6,6.17 34.29,6.17 C1.1 | 1.14,26.75 8.69,26.75 C2.1
  Bottom 0.254: 50.75,28.57 50.06,29.26 50.06,32.69 51.89,34.52 JP3.7 | 50.75,28.57 50.98,28.35 53.03,28.35 56.69,32 57.84,32 X1.7 | 36.35,8.46 34.29,6.4 C1.1 | 50.75,28.57 46.63,24.46 46.63,15.77 41.15,10.29 41.15,8.46 40.46,7.77 38.41,7.77 37.72,8.46 36.35,8.46 | 36.35,8.46 v36.35,8.69 | MC1.P$23 31.55,36.8 30.18,35.43 27.89,35.43 24.23,31.77 IC2.8 24,31.77 21.95,31.77 19.66,34.06 16,34.06 14.17,32.23 14.17,31.77 OK1.7 13.95,31.77 8.91,26.75 C2.1 8.69,26.52 8.69,20.34 7.77,19.43 7.77,18.75 8.69,17.83 8.69,16.69 R8.1 | 8.69,63.09 8.69,64.69 IC3.14 | 8.69,63.09 8.69,62.18 6.4,59.89 C4.1 | 8.69,63.09 24.69,63.09 26.29,64.69 29.03,64.69 IC4.8
VDD
  Top 0.254: 44.58,24.46 44.58,26.52 JP1.3 44.58,26.75 45.72,27.89 45.72,32.23 45.03,32.92 43.89,32.92 40.01,36.8 39.55,36.8 MC1.P$20 | 44.58,24.46 44.58,24.23 JP1.1 44.58,24.46 | 44.58,24.46 49.38,19.66 51.89,19.66 JP3.1
  Bottom 0.254: X1.1 57.84,39.78 57.84,38.63 55.09,35.89 50.75,35.89 47.32,32.46 47.32,29.49 44.58,26.75 JP1.3
XMIDIRX
  Top 0.254: IC2.1 24.23,24 24.23,19.2 S1.3

### Text on the board
Document: 1 | 1 | 1 | 1 | PINEAPPLE II NITROGEN / REVISION 1.0.0 (2015)